# EAGLE design Adafruit Qualia Driver (EAGLE 6.5.0)
COMPANY: ADAFRUIT INDUSTRIES; DRAWN: K. TOWNSEND; REV: D
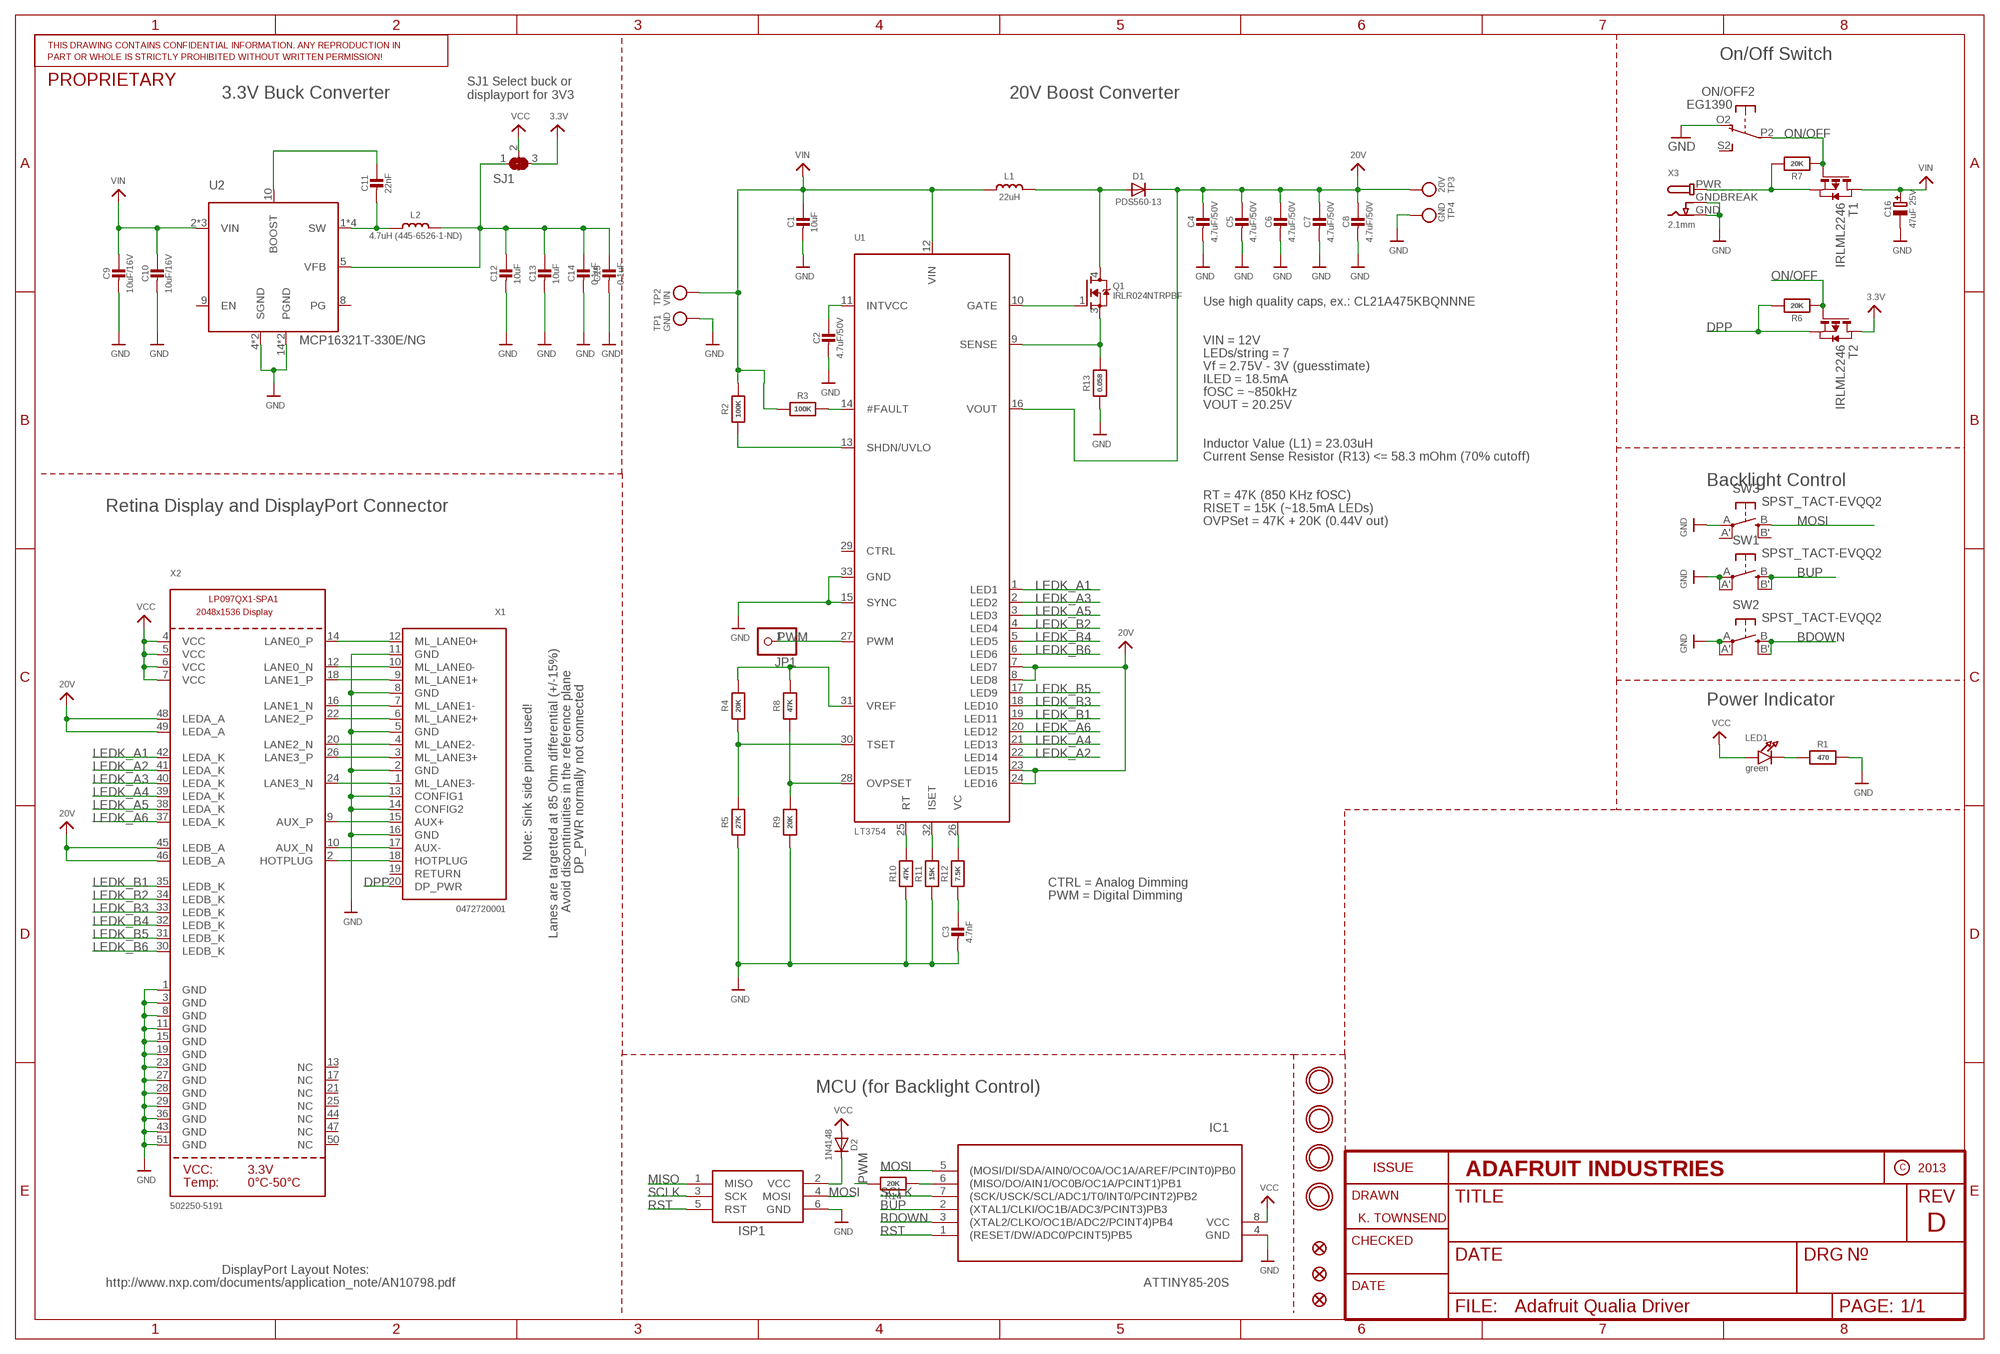
[diagram p0: schematic, sheet 1]

## Parts
C1  10uF  CAP_CERAMIC_0805  [_0805]
C2  4.7uF/50V  CAP_CERAMIC_0805  [_0805]
C3  4.7nF  CAP_CERAMIC_0805  [_0805]
C4  4.7uF/50V  CAP_CERAMIC_0805  [_0805]
C5  4.7uF/50V  CAP_CERAMIC_0805  [_0805]
C6  4.7uF/50V  CAP_CERAMIC_0805  [_0805]
C7  4.7uF/50V  CAP_CERAMIC_0805  [_0805]
C8  4.7uF/50V  CAP_CERAMIC_0805  [_0805]
C9  10uF/16V  CAP_CERAMIC_0805  [_0805]
C10  10uF/16V  CAP_CERAMIC_0805  [_0805]
C11  22nF  CAP_CERAMIC_0805  [_0805]
C12  10uF  CAP_CERAMIC_0805  [_0805]
C13  10uF  CAP_CERAMIC_0805  [_0805]
C14  0.1uF  CAP_CERAMIC_0805  [_0805]
C15  0.1uF  CAP_CERAMIC_0805  [_0805]
C16  47uF 25V  CAP_ELECTROLYTICPANASONIC_C  [PANASONIC_C]
D1  PDS560-13  DIODEPOWERDI  [POWERDI-5]
D2  1N4148  DIODESOD-323  [SOD-323]
FID1  FIDUCIAL""  [FIDUCIAL_1MM]
FID2  FIDUCIAL""  [FIDUCIAL_1MM]
FID3  FIDUCIAL""  [FIDUCIAL_1MM]
IC1  ATTINY85-20S  [SOIC8]
ISP1  AVRISP-6  [AVRISP]
JP1  PINHD-1X1CB  [1X01-CLEANBIG]
L1  22uH  INDUCTORCDRH5D28  [INDUCTOR_6X6MM_SUMIDA_CDRH5D28]
L2  4.7uH (445-6526-1-ND)  INDUCTORTDK_VLC5045  [INDUCTOR_5X5MM_TDK_VLC5045]
LED1  green  LED0805  [CHIPLED_0805]
ON/OFF  EG1390  DPDT-EG1390  [EG1390]
Q1  IRLR024NTRPBF  MOSFET-NDPAK  [DPAK]
R1  470  RESISTOR_0805  [_0805]
R2  100K  RESISTOR_0805  [_0805]
R3  100K  RESISTOR_0805  [_0805]
R4  20K  RESISTOR_0805  [_0805]
R5  27K  RESISTOR_0805  [_0805]
R6  20K  RESISTOR_0805MP  [_0805MP]
R7  20K  RESISTOR_0805MP  [_0805MP]
R8  47K  RESISTOR_0805  [_0805]
R9  20K  RESISTOR_0805  [_0805]
R10  47K  RESISTOR_0805  [_0805]
R11  15K  RESISTOR_0805  [_0805]
R12  7.5K  RESISTOR_0805  [_0805]
R13  0.058  RESISTOR2512  [2512]
R14  20K  RESISTOR_0805  [_0805]
SJ1  SOLDERJUMPER_2WAY  [SOLDERJUMPER_2WAY_OPEN_NOPASTE]
SW1  SPST_TACT-EVQQ2  [EVQ-Q2]
SW2  SPST_TACT-EVQQ2  [EVQ-Q2]
SW3  SPST_TACT-EVQQ2  [EVQ-Q2]
T1  IRLML2246  PMOSSOT23  [SOT-23]
T2  IRLML2246  PMOSSOT23  [SOT-23]
TP1  GND  TESTPOINTROUND1MM  [TESTPOINT_ROUND_1MM]
TP2  VIN  TESTPOINTROUND1MM  [TESTPOINT_ROUND_1MM]
TP3  20V  TESTPOINTROUND1MM  [TESTPOINT_ROUND_1MM]
TP4  GND  TESTPOINTROUND1MM  [TESTPOINT_ROUND_1MM]
U1  LT3754  VREG_LT3754  [QFN32_5MM]
U2  MCP16321T-330E/NG  VREG_MCP16321/2  [QFN16_3MM]
U$11  MOUNTINGHOLE3.0THIN  [MOUNTINGHOLE_3.0_PLATEDTHIN]
U$32  MOUNTINGHOLE3.0THIN  [MOUNTINGHOLE_3.0_PLATEDTHIN]
U$33  MOUNTINGHOLE3.0THIN  [MOUNTINGHOLE_3.0_PLATEDTHIN]
U$34  MOUNTINGHOLE3.0THIN  [MOUNTINGHOLE_3.0_PLATEDTHIN]
X1  0472720001  DISPLAYPORTSINKSIDE  [DISPLAYPORT_0472720001]
X2  502250-5191  DISP_DISPLAYPORT_LP097QX1-SPA1HANDSOLDERING  [FPC_51PIN_502250-5191_EXT]
X3  2.1mm  DCBARRELSMT_CORRECT  [DCJACK_2MM_SMT]

## Nets
3.3V: SJ1.3 T2.1(D)
20V: C4.1 C5.1 C6.1 C7.1 C8.1 D1.C TP3.P$1 U1.7(LED7) U1.8(LED8) U1.16(VOUT) U1.23(LED15) U1.24(LED16) X2.45(LEDB_A) X2.46(LEDB_A) X2.48(LEDA_A) X2.49(LEDA_A)
AUX+: X1.15(AUX+) X2.9(AUX_P)
AUX-: X1.17(AUX-) X2.10(AUX_N)
BDOWN: IC1.3((XTAL2/CLKO/OC1B/ADC2/PCINT4)PB4) SW2.B'(S1) SW2.B(S)
BUP: IC1.2((XTAL1/CLKI/OC1B/ADC3/PCINT3)PB3) SW1.B'(S1) SW1.B(S)
DPP: R6.2 T2.2(S) X1.20(DP_PWR)
GND: C1.2 C2.2 C3.2 C4.2 C5.2 C6.2 C7.2 C8.2 C9.2 C10.2 C12.2 C13.2 C14.2 C15.2 C16.- IC1.4(GND) ISP1.6(GND) ON/OFF.O2(2:O) R1.2 R5.1 R9.1 R10.1 R11.1 R13.1 SW1.A'(P1) SW1.A(P) SW2.A'(P1) SW2.A(P) SW3.A(P) TP1.P$1 TP4.P$1 U1.15(SYNC) U1.33(GND) U2.4(SGND) U2.14(PGND) U2.15(PGND) U2.THERMAL(SGND) X1.2(GND) X1.5(GND) X1.8(GND) X1.11(GND) X1.13(CONFIG1) X1.14(CONFIG2) X1.16(GND) X2.1(GND) X2.3(GND) X2.8(GND) X2.11(GND) X2.15(GND) X2.19(GND) X2.23(GND) X2.27(GND) X2.28(GND) X2.29(GND) X2.36(GND) X2.43(GND) X2.51(GND) X3.GND X3.GNDBREAK
HOTPLUG: X1.18(HOTPLUG) X2.2(HOTPLUG)
LEDK_A1: U1.1(LED1) X2.42(LEDA_K)
LEDK_A2: U1.22(LED14) X2.41(LEDA_K)
LEDK_A3: U1.2(LED2) X2.40(LEDA_K)
LEDK_A4: U1.21(LED13) X2.39(LEDA_K)
LEDK_A5: U1.3(LED3) X2.38(LEDA_K)
LEDK_A6: U1.20(LED12) X2.37(LEDA_K)
LEDK_B1: U1.19(LED11) X2.35(LEDB_K)
LEDK_B2: U1.4(LED4) X2.34(LEDB_K)
LEDK_B3: U1.18(LED10) X2.33(LEDB_K)
LEDK_B4: U1.5(LED5) X2.32(LEDB_K)
LEDK_B5: U1.17(LED9) X2.31(LEDB_K)
LEDK_B6: U1.6(LED6) X2.30(LEDB_K)
MISO: IC1.6((MISO/DO/AIN1/OC0B/OC1A/PCINT1)PB1) ISP1.1(MISO) R14.1
MOSI: IC1.5((MOSI/DI/SDA/AIN0/OC0A/OC1A/AREF/PCINT0)PB0) ISP1.4(MOSI) SW3.B(S)
N$1: X1.12(ML_LANE0+) X2.14(LANE0_P)
N$2: X1.10(ML_LANE0-) X2.12(LANE0_N)
N$3: X1.9(ML_LANE1+) X2.18(LANE1_P)
N$4: X1.7(ML_LANE1-) X2.16(LANE1_N)
N$5: X1.6(ML_LANE2+) X2.22(LANE2_P)
N$6: X1.4(ML_LANE2-) X2.20(LANE2_N)
N$7: X1.3(ML_LANE3+) X2.26(LANE3_P)
N$8: X1.1(ML_LANE3-) X2.24(LANE3_N)
N$9: C2.1 U1.11(INTVCC)
N$10: R2.1 U1.13(SHDN/UVLO)
N$11: R3.2 U1.14(#FAULT)
N$12: R12.2 U1.26(VC)
N$13: C3.1 R12.1
N$14: LED1.C R1.1
N$15: R4.1 R5.2 U1.30(TSET)
N$16: R4.2 R8.2 U1.31(VREF)
N$17: R7.2 T1.2(S) X3.PWR
N$19: R8.1 R9.2 U1.28(OVPSET)
N$20: R10.2 U1.25(RT)
N$21: D2.C ISP1.2(VCC)
N$22: R11.2 U1.32(ISET)
N$23: Q1.3(S) R13.2 U1.9(SENSE)
N$24: Q1.1(G) U1.10(GATE)
N$25: D1.A1(A) D1.A2(A) L1.P$2 Q1.4(D)
N$27: C12.1 C13.1 C14.1 C15.1 L2.P$2 SJ1.1 U2.5(VFB)
N$28: C11.1 U2.10(BOOST)
N$29: C11.2 L2.P$1 U2.1(SW) U2.12(SW) U2.13(SW) U2.16(SW)
ON/OFF: ON/OFF.P2(2:P) R6.1 R7.1 T1.3(G) T2.3(G)
PWM: JP1.1 R14.2 U1.27(PWM)
RST: IC1.1((RESET/DW/ADC0/PCINT5)PB5) ISP1.5(RST)
SCLK: IC1.7((SCK/USCK/SCL/ADC1/T0/INT0/PCINT2)PB2) ISP1.3(SCK)
VCC: D2.A IC1.8(VCC) LED1.A SJ1.2 X2.4(VCC) X2.5(VCC) X2.6(VCC) X2.7(VCC)
VIN: C1.1 C9.1 C10.1 C16.+ L1.P$1 R2.2 R3.1 T1.1(D) TP2.P$1 U1.12(VIN) U2.2(VIN) U2.3(VIN) U2.11(VIN)
Unconnected: ON/OFF.O1(1:O) ON/OFF.P1(1:P) ON/OFF.S1(1:S) ON/OFF.S2(2:S) SW3.A'(P1) SW3.B'(S1) U1.29(CTRL) U2.8(PG) U2.9(EN) X1.19(RETURN) X2.13(NC) X2.17(NC) X2.21(NC) X2.25(NC) X2.44(NC) X2.47(NC) X2.50(NC)

## Notes on the sheet
- On/Off Switch
- 3.3V Buck Converter
- SJ1 Select buck or
  displayport for 3V3
- 20V Boost Converter
- Use high quality caps, ex.: CL21A475KBQNNNE
- VIN = 12V
- LEDs/string = 7
- Vf = 2.75V - 3V (guesstimate)
- ILED = 18.5mA
- fOSC = ~850kHz
- VOUT = 20.25V
- Inductor Value (L1) = 23.03uH
- Current Sense Resistor (R13) <= 58.3 mOhm (70% cutoff)
- Backlight Control
- RT = 47K (850 KHz fOSC)
- Retina Display and DisplayPort Connector | RISET = 15K (~18.5mA LEDs)
- OVPSet = 47K + 20K (0.44V out)
- Power Indicator
- Note: Sink side pinout used!
- DP_PWR normally not connected
- CTRL = Analog Dimming
- PWM = Digital Dimming
- Avoid discontinuities in the reference plane
- Lanes are targetted at 85 Ohm differential (+/-15%)
- MCU (for Backlight Control)
- DisplayPort Layout Notes:
- http://www.nxp.com/documents/application_note/AN10798.pdf

## Library data of the parts
C1-C15 = microbuilder:CAP_CERAMIC: Ceramic Capacitors For new designs, use the packages preceded by an '_' character since they are more reliable: The following footprints should be used on most boards: _0402 - Standard footprint for regular board layouts _0603 - Standard footprint for regular board layouts _0805 - Standard footprint for regular board layouts _1206 - Standard footprint for regular board layouts For extremely tight-pitch boards where space is at a premium, the following 'micro-pitch' footprints can be used (smaller pads, no silkscreen outline, etc.): _0402MP - Micro-pitch footprint for very dense/compact boards _0603MP - Micro-pitch footprint for very dense/compact boards _0805MP - Micro-pitch footprint for very dense/compact boards _1206MP - Micro-pitch footprint for very dense/compact boards
C16 = microbuilder:CAP_ELECTROLYTIC: Electrolytic Capacitors SMT PANASONIC_C - Size C Panasonic Electrolytic Aluminum Capacitor 47µF 16V 20% Electrolytic Capacitor [Digikey: PCE3890TR-ND] PANASONIC_D - Size D Panasonic Electrolytic Aluminum Capacitor 100µF 25V 20% Electrolytic Capacitor [Digikey: PCE3898TR-ND] PTH 3.5 mm grid, 8 mm diameter ... 3.5 mm grid, 10 mm diameter ...
D1 D2 = microbuilder:DIODE: Diode SMA Model Volts Amps Type Vf Ir Digikey # Notes SSA34-E3 40V 3A Schottky 480mV @ 3A 200uA @ 40V SSA34-E3/61TGITR-ND CDBA120-G 20V 1A Schottky 500mV @ 1A 500uA @ 20V 641-1014-6-ND REEL MBRA210 10V 2A Schottky 350mV @ 2A 700uA @ 10V MBRA210LT3 SOD-123 Model Volts Amps Type Vf Ir Order # Notes BAT54T1G 30V 200mA Schottky 800mV @ 200mA 2uA @ 25V BAT54T1GOSTR-ND B0530W 30V 500mA Schottky 430mV @ 500mA 130uA @ 30V B0530W-FDICT-ND REEL MBR120 20V 1A Schottky 340mV @ 1A MBR120VLSFT1GOSCT-ND SOD-323 Model Volts Amps Type Vf Ir Order # Notes PMEG2005EJ 20V 500mA Schottky 355mV @ 500mA 568-4110-1-ND ZLLS410 10V 570mA Schottky 380mV @ 570mA ZLLS410CT-ND 1N4148WS 75V 150mA Silicon/Simple 1V 1N4148WSFSCT-ND REEL SOD-523 Model Volts Amps Type Vf Ir Order # Notes BAT54XV2 30V 200mA Schottky 0.8V @ 100mA BAT54XV2CT-ND TB751S 30V 30mA Schottky RB751S-40TE61CT-ND SOT23-R/W (R = Solder Paste/Reflow Ovens, W = Hand-Soldering) Model Volts Amps Type Vf Ir Order # Notes BAT54FILM 40V 300mA Schottky 497-7162-1-ND POWERDI-5 Model Volts Amps Type Vf Ir Order # Notes PDS560 60V 5A Schottky 670mV @ 5A 150uA @ 60V PDS560DICT-ND
FID1-FID3 = microbuilder:FIDUCIAL: Fiducial Alignment Points Various fiducial points for machine vision alignment.; BOM: EXCLUDE
IC1 = avr:ATTINY85: MICROCONTROLLER 8 Kbytes FLASH 512 bytes EEPROM 512 bytes RAM 4-channel 10 bit ADC USI
ISP1 = adafruit:AVRISP: AVR ISP HEADER Standard 6 pin header for AVR programming
JP1 = adafruit:PINHD-1X1: Pin header 1x1 for 0.1" spacing With round pins
L1 L2 = microbuilder:INDUCTOR: Inductors 0603: 10nH Ceramic Inductor - microwire antenna/RF (Digikey: 712-1434-2-ND) 0805: 560nH Ceramic Inductor - RF (Digikey: 553-1047-1-ND) 270nH Ceramic Inductor - Q = 40@250MHz, +-5%, 1 Ohm DC Resistance (Digikey: 535-10506-2-ND) 1007 (2518 Metric) SMT: 10µH 10% 250mOhm 820mA 1007 Inductor (Digikey: 587-2189-1-ND) 22µH 10% 500mOhm 580mA 1007 Inductor (Digikey: 587-2190-1-ND) 47µH 10% 950mOhm 420mA 1007 Inductor (Digikey: 587-2191-1-ND) 47µH 5% 100mOhm 1A 1008 Inductor (Digikey: 732-1816-1-ND) 5.0x5.0mm (Taiyo Yuden NR5040 Series) 6.8µH 20% 2.3A 64mOhm Inductor (Digikey: 587-2374-2-ND) 5.0x5.0mm (TDK VLC5045 Series) 4.7µH 20% 3.3A 34mOhm Inductor (Digikey: 445-6526-1-ND) 6.8µH 20% 2.7A 46mOhm Inductor (Digikey: 445-6527-1-ND) 6.0x6.0mm (TDK VLC6045 Series) 4.7µH 20% 3.8A 27mOhm Inductor (Digikey: 445-6538-2-ND) 6.8µH 20% 3A 41mOhm Inductor (Digikey: 445-6540-1-ND) 6.2µH 30% 2.2A 45mOhm Inductor (Digikey: SRR5028-6R2YCT-ND) - Not TDK VLC6045 but footprint should match 6.0x6.0mm (TDK SLF6045 Series) 6.8uH 30% 2A 33mOhm Inductor (Digikey: 445-4572-1-ND, Mouser: 810-SLF645T6R8N2R0PF) 6.0x6.0mm (Sumida CDRH5D28 Series) 6.2uH 30% 1.8A 45mOhm Inductor (Digikey: 308-1542-1-ND) Taiyo Yuden NR3015T2R2M - 2.2uH 20% 1.5A (Digikey: 587-1648-2-ND, Mouser: 963-NR3015T2R2M) - Used with TI TPS62172 CoilCraft RFID Transponder Coil - MA5532-AE (For use with AS3935 Lightning Sensor)
LED1 = microbuilder:LED: LED 0603 - 0603 Surface Mount Package 2mA: Green LED - Low Power (3.9mcd, 2ma, 1.7Vf) - Digikey: 475-2709-2-ND Orange LED - Low Power (9.8mcd, 2ma, 1.8Vf) - Digikey: 475-1194-2-ND Red LED - Low Power (5mcd, 2ma, 1.8Vf) - Digikey: 475-1195-2-ND Yellow LED - Low Power (7mcd, 2ma, 1.8Vf) - Digikey: 475-1196-2-ND 5mA: Blue LED - Low Power (17mcd, 5ma, 2.9Vf) - Digikey: LNJ937W8CRACT-ND 0805 - 0805 Surface Mount Package 2mA: Red LED (8.8mcd, 2mA, 1.8Vf, Clear) - Low Power [Digikey: 475-2510-1-ND] Green LED (5mcd, 2mA, 1.8Vf, Clear) - Low Power [Digikey: 475-2730-1-ND] Yellow LED (11.3mcd, 2mA, 1.8Vf, Clear) - Low Power [Digikey: 475-2555-1-ND] 20mA: Red LED (104mcd, 20mA, Diffused) - LS R976 [Digikey: 475-1278-6-ND] Red LED (12mcd, 20mA, 2.0Vf, Clear) - APT2012EC [Digikey: 754-1128-1-ND] Green LED (15mcd, 20mA, 2.2Vf, Clear) - APT2012GC [Digikey: 754-1131-1-ND] Orange LED (160mcd, 20mA, 2.1Vf, Clear) - APT2012SECK [Digikey: 754-1130-1-ND] 1206 - 1206 Surface Mount Package Green LED (26mcd, 20mA, Diffused) - LG N971 [Digikey: 475-1407-6-ND] Red LED (15mcd, 20mA, Diffused) - LH N974 [Digikey: 475-1416-6-ND] Cree - Cree High-Power Surface Mount LEDs XPEBWT-L1-0000-00D50 - White 111lm 350mA 2.9Vf 6200K 110° XTEAWT-00-0000-00000LEE3 - White 114lm 350mA 2.85Vf 5000K 115° Everlight - Everlight 45-21 Series Surface Mount LEDs 45-21/QK2C-B2832AC2CB2/2T - Warm White 2000mcd 20mA 3.25Vf 3050K 120° 45-21/LK2C-B38452C4CB2/2T - Nuetral White 2000mcd 20mA 3.25Vf 4150K 120° 45-21/LK2C-B50634C6CB2/2T - Cold White 2200mcd 20mA 3.25Vf 5650K 120° PLCC2 Reverse Mount LS T77K-J1L2-1-0-2-R18-Z - Red 11.25mcd 2mA 1.8Vf 630nm 120° LO T77K-L1M2-24-Z - Orange 19.6mcd 2mA 1.8Vf 606nm 120° LY T77K-K2M1-26-Z - Yellow 15.7mcd 2mA 1.8Vf 587nm 120°
ON/OFF = adafruit:DPDT
Q1 = microbuilder:MOSFET-N: N-Channel Mosfet LEGEND VDS: Voltage Drain-Source ID: Drain Current RDS(ON): Drain-Source On-State Resistance VGS(TH): Gate-Source Threshold Voltage CISS: Drain-Source Input Capacitance SOT-23 Name VDS ID RDS(ON) VGS(TH) CISS Order Number 2N7002E 60V 260mA 2.5 Ohm 2.5V @ 250uA 26.7pF @ 25V 2N7002ET1GOSTR-ND BSH103 30V 850mA 400 mOhm 400mV @ 1mA 83pF @ 24V BSH103,235-ND BSS138 60V 320mA 1.6 Ohm 1.5V @ 250uA 50pF @ 10V Mouser: 771-BSS138PW115 DMN2075U-7 20V 4.2A 38 mOhm 1V @ 250 uA 594.3pF @ 10V DMN2075U-7DICT-ND * BSS138 good choice for I2C level-shifting POWERPAK 1212-8 Name VDS ID RDS(ON) VGS(TH) CISS Order Number Si7308DN 60V 6A 58 mOhm 3V @ 250uA 665pF @ 15V SI7308DN-T1-E3CT-ND
R1-R14 = microbuilder:RESISTOR: Resistors For new designs, use the packages preceded by an '_' character since they are more reliable: The following footprints should be used on most boards: _0402 - Standard footprint for regular board layouts _0603 - Standard footprint for regular board layouts _0805 - Standard footprint for regular board layouts _1206 - Standard footprint for regular board layouts For extremely tight-pitch boards where space is at a premium, the following 'micro-pitch' footprints can be used (smaller pads, no silkscreen outline, etc.): _0402MP - Micro-pitch footprint for very dense/compact boards _0603MP - Micro-pitch footprint for very dense/compact boards _0805MP - Micro-pitch footprint for very dense/compact boards _1206MP - Micro-pitch footprint for very dense/compact boards
SJ1 = microbuilder:SOLDERJUMPER_2WAY: 2-Way Solder Jumper
SW1-SW3 = adafruit:SPST_TACT: SMT 6mm switch, EVQQ2 series http://www.ladyada.net/library/eagle
T1 T2 = zetex:PMOSSOT23: MOS FET
TP1-TP4 = microbuilder:TESTPOINT: Test Point Various test points for characterisation and PCB testing TESTPOINT_SMT - Compact Surface Mount Test Point [Digikey: 5016KTR-ND]
U1 = microbuilder:VREG_LT3754: LT3754 - 16-Channel x 50mA per LED Boost 6V to 40V Input Up to 45V Output (per channel) Single resistor sets current (10-50mA)
U2 = microbuilder:VREG_MCP16321/2: MCP16321/2 - 24V, 1A/2A Buck Regulator Input Voltage: 6-24V Output Current: 1A (MCP16321), 2A (MCP16322) Output Frequency: 1MHz Operating Temperature: -40 - 125°C
U$11 U$32-U$34 = microbuilder:MOUNTINGHOLE: Mounting Hole For #2 screws (0.086"/2.18mm width, 0.094"/2.4mm hole) use 2.5mm; BOM: EXCLUDE
X1 = microbuilder:DISPLAYPORT: 20-Pin DisplayPort Connector Connector: Molex 0472720001 Warning: Note the difference between source and sink side pinouts! For pinout information see: http://www.displayport.net/wp-content/uploads/2012/10/displayport_pinout11a.gif
X2 = microbuilder:DISP_DISPLAYPORT_LP097QX1-SPA1: Connector: Molex 502250-5191
X3 = microbuilder:DCBARREL: DC Barrel Jack DCJACK_1.3MM_PTH - Through Hole 1.3mm Jack (4UConnector: 05536) DCJACK_2MM_PTH - Through Hole 2.0/2.1 Jack (4UConnector: 05537) DCJACK_2MM_SMT - SMT 2.0/2.1mm Jack(4UConnector: 03267)

## Board
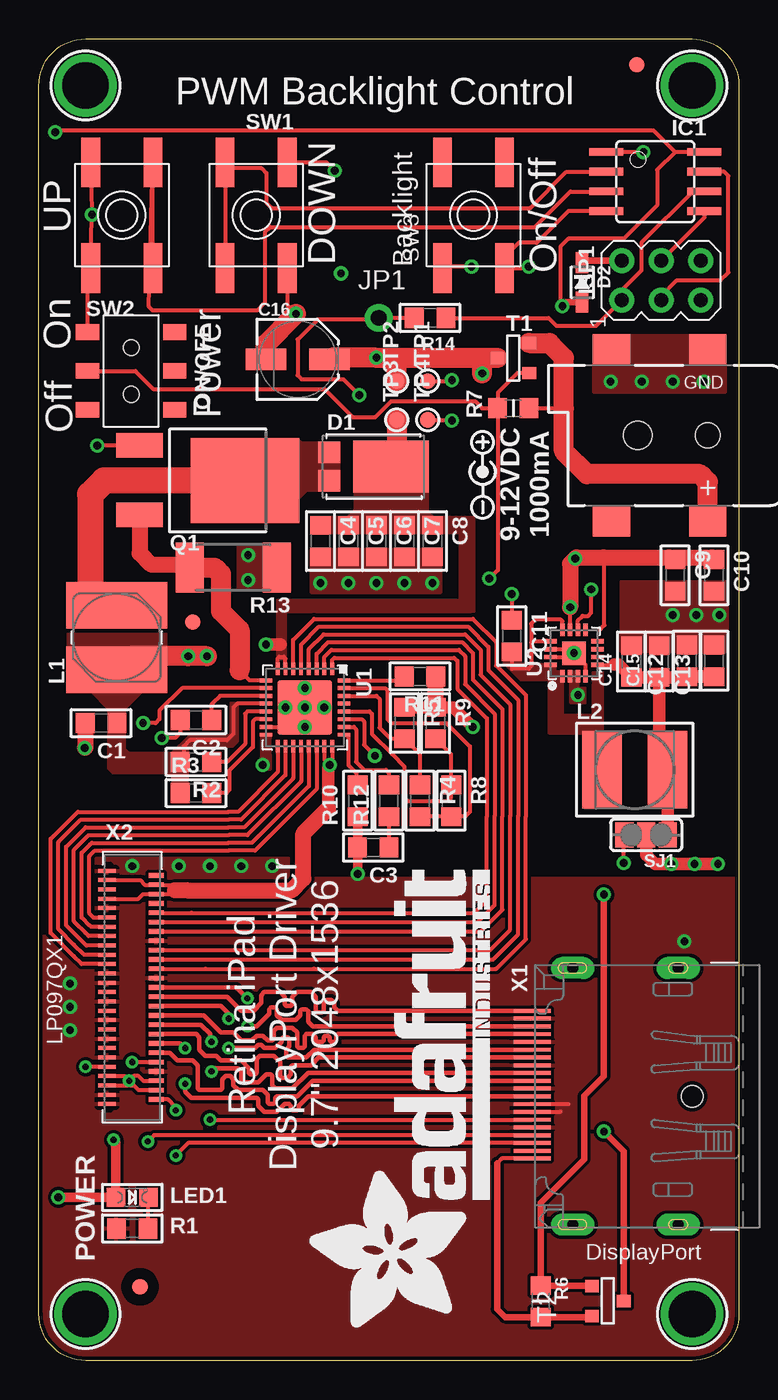
[diagram p1: board, top side]
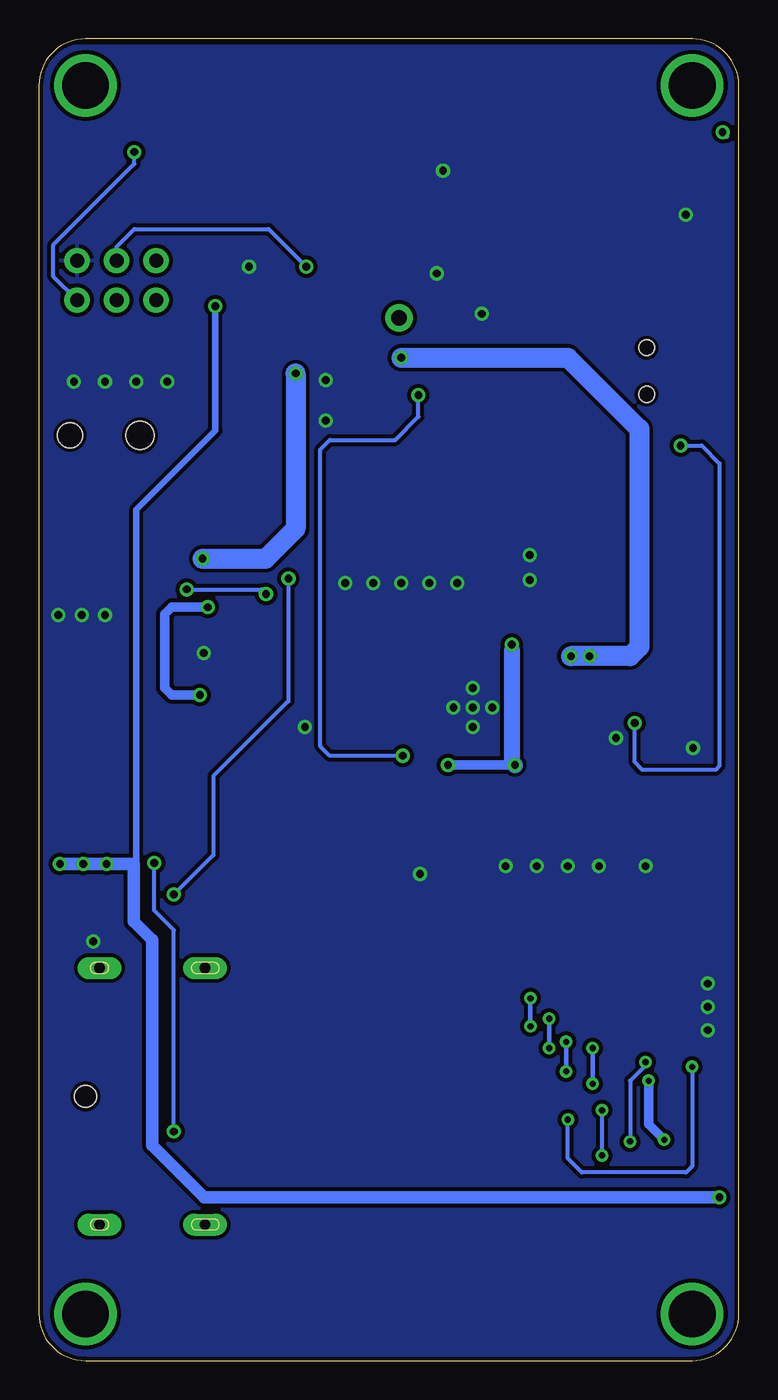
[diagram p2: board, bottom side, seen from below]

Size 45 x 85 mm. Coordinates in mm from the lower left corner, seen from the top.
Outline: 0,3 0,82 arc-90 3,85 42,85 arc-90 45,82 45,3 arc-90 42,0 3,0 arc-90 0,3
Copper layers (1*16): Top 0.035mm / dielectric 1.5mm / Bottom 0.035mm
Design rules "adafruit": minimum track width 8mil, minimum drill 15.5mil, track to track 8mil, track to pad 8mil, pad to pad 8mil, via to via 8mil, smd to smd 8mil, copper to edge 10mil, drill to drill 8mil, minimum pad ring 10mil, minimum via ring 8mil, stop-mask expansion 4mil, vias tented up to drill 20mil, thermal gap 10mil
tRestrict: area 31.5,16.2 to 31.9,16.3; area 4.2,24.6 to 4.5,24.6; area 4.2,31.8 to 4.6,31.9; area 4.2,16.8 to 4.6,16.9; area 4.2,16.2 to 4.6,16.2

### Footprints (pad centres in the part's own frame; a part is rotated, then mirrored left to right if it is on the bottom)
_0805 = smd 1.2 x 1.3: 1 -1.016,0; 2 1.016,0
PANASONIC_C = smd 2.6 x 1.4: + 2.05,0; - -2.05,0
POWERDI-5 = smd 1.39 x 1.4: A1 -0.92,-2.84; A2 0.92,-2.84 | smd 3.36 x 4.86: C 0,1.142
SOD-323 = smd 1.35 x 0.8: A 1.27,0; C -1.27,0
FIDUCIAL_1MM = smd 1 x 1: 1 0,0
SOIC8 = smd 0.5 x 2.2: 1 -1.905,-3.154; 2 -0.645,-3.154; 3 0.625,-3.154; 4 1.895,-3.154; 5 1.905,3.154; 6 0.635,3.154; 7 -0.635,3.154; 8 -1.905,3.154
AVRISP = drill 0.9 pad 1.626: 1 -1.27,2.54; 2 1.27,2.54; 3 -1.27,0; 4 1.27,0; 5 -1.27,-2.54; 6 1.27,-2.54
1X01-CLEANBIG = drill 1.016 pad 1.778: 1 0,0
INDUCTOR_6X6MM_SUMIDA_CDRH5D28 = smd 3 x 6.5: P$1 -2.075,0; P$2 2.075,0
INDUCTOR_5X5MM_TDK_VLC5045 = smd 2.54 x 5: P$1 -2.096,0; P$2 2.096,0
CHIPLED_0805 = smd 1.2 x 1.2: A 0,-1.05; C 0,1.05
EG1390 = smd 1 x 1.5: O1 -2.5,2.8; O2 -2.5,-2.8; P1 0,2.8; P2 0,-2.8; S1 2.5,2.8; S2 2.5,-2.8 | hole 1: 1.5,0; -1.5,0
DPAK = smd 1.6 x 2.997: 1 -2.261,-4.928; 3 2.21,-4.928 | smd 5.452 x 7: 4 0,1.853
_0805MP = smd 1.2 x 1.3: 1 -1.016,0; 2 1.016,0
2512 = smd 1.8 x 3.2: 1 -2.8,0; 2 2.8,0
SOLDERJUMPER_2WAY_OPEN_NOPASTE = smd 1.168 x 1.6: 1 -1.397,0; 2 0,0; 3 1.397,0
EVQ-Q2 = smd 3.2 x 1.2: A -3.4,-2; A' 3.4,-2; B -3.4,2; B' 3.4,2
SOT-23 = smd 0.787 x 0.889: 1 0.025,-1.016; 2 -0.94,1.016; 3 0.991,1.016
TESTPOINT_ROUND_1MM = smd 1 x 1: P$1 0,0
QFN32_5MM = smd 0.8 x 0.25: 1 -2.5,1.75; 2 -2.5,1.25; 3 -2.5,0.75; 4 -2.5,0.25; 5 -2.5,-0.25; 6 -2.5,-0.75; 7 -2.5,-1.25; 8 -2.5,-1.75; 17 2.5,-1.75; 18 2.5,-1.25; 19 2.5,-0.75; 20 2.5,-0.25; 21 2.5,0.25; 22 2.5,0.75; 23 2.5,1.25; 24 2.5,1.75 | smd 0.25 x 0.8: 9 -1.75,-2.5; 10 -1.25,-2.5; 11 -0.75,-2.5; 12 -0.25,-2.5; 13 0.25,-2.5; 14 0.75,-2.5; 15 1.25,-2.5; 16 1.75,-2.5; 25 1.75,2.5; 26 1.25,2.5; 27 0.75,2.5; 28 0.25,2.5; 29 -0.25,2.5; 30 -0.75,2.5; 31 -1.25,2.5; 32 -1.75,2.5 | smd 3.5 x 3.5: 33 0,0
QFN16_3MM = smd 0.8 x 0.28: 1 -1.5,0.75; 2 -1.5,0.25; 3 -1.5,-0.25; 4 -1.5,-0.75; 9 1.5,-0.75; 10 1.5,-0.25; 11 1.5,0.25; 12 1.5,0.75 | smd 0.28 x 0.8: 5 -0.75,-1.5; 6 -0.25,-1.5; 7 0.25,-1.5; 8 0.75,-1.5; 13 0.75,1.5; 14 0.25,1.5; 15 -0.25,1.5; 16 -0.75,1.5 | smd 1.5 x 1.5: THERMAL 0,0
MOUNTINGHOLE_3.0_PLATEDTHIN = drill 3 pad 3.6: P$1 0,0
DISPLAYPORT_0472720001 = smd 0.25 x 2.4: 1 5.5,10.28; 2 5,10.28; 3 4.5,10.28; 4 4,10.28; 5 3.5,10.28; 6 3,10.28; 7 2.5,10.28; 8 2,10.28; 9 1.5,10.28; 10 1,10.28; 11 0.5,10.28; 12 0,10.28; 13 -0.5,10.28; 14 -1,10.28; 15 -1.5,10.28; 16 -2,10.28; 17 -2.5,10.28; 18 -3,10.28; 19 -3.5,10.28; 20 -4,10.28 | drill 0.7 pad 1.4 long: P$2 8.25,0.9; P$3 -8.25,0.9; P$4 8.25,7.68; P$5 -8.25,7.68 | hole 1.4: 0,0
FPC_51PIN_502250-5191_EXT = smd 0.26 x 1.1: 1 7.5,-1.625; 3 6.9,-1.625; 5 6.3,-1.625; 7 5.7,-1.625; 9 5.1,-1.625; 11 4.5,-1.625; 13 3.9,-1.625; 15 3.3,-1.625; 17 2.7,-1.625; 19 2.1,-1.625; 21 1.5,-1.625; 23 0.9,-1.625; 25 0.3,-1.625; 27 -0.3,-1.625; 29 -0.9,-1.625; 31 -1.5,-1.625; 33 -2.1,-1.625; 35 -2.7,-1.625; 37 -3.3,-1.625; 39 -3.9,-1.625; 41 -4.5,-1.625; 43 -5.1,-1.625; 45 -5.7,-1.625; 47 -6.3,-1.625; 49 -6.9,-1.625; 51 -7.5,-1.625 | smd 0.3 x 0.95: 2 7.2,1.55; 4 6.6,1.55; 6 6,1.55; 8 5.4,1.55; 10 4.8,1.55; 12 4.2,1.55; 14 3.6,1.55; 16 3,1.55; 18 2.4,1.55; 20 1.8,1.55; 22 1.2,1.55; 24 0.6,1.55; 26 0,1.55; 28 -0.6,1.55; 30 -1.2,1.55; 32 -1.8,1.55; 34 -2.4,1.55; 36 -3,1.55; 38 -3.6,1.55; 40 -4.2,1.55; 42 -4.8,1.55; 44 -5.4,1.55; 46 -6,1.55; 48 -6.6,1.55; 50 -7.2,1.55
DCJACK_2MM_SMT = smd 2.4 x 2: GND 0,-5.5; GNDBREAK 6.2,-5.5; PWR 0,5.5; PWR2 6.2,5.5 | hole 1.6: 0,0 | hole 1.8: 4.5,0

### Placement (x,y rotation side)
C1  4,41 180 top
C2  10.1,41.2 180 top
C3  21.5,33 180 top
C4  18.1,52.7 270 top
C5  19.9,52.7 270 top
C6  21.7,52.7 270 top
C7  23.5,52.7 270 top
C8  25.3,52.7 270 top
C9  40.9,50.5 270 top
C10  43.4,50.5 270 top
C11  30.4,46.6 270 top
C12  41.66,45 90 top
C13  43.4,45 90 top
C14  38.1,44.96 90 top
C15  39.88,44.96 90 top
C16  16.64,64.39 0 top
D1  21.5,57.5 270 top
D2  34.92,69.34 270 top
FID1  6.5,4.75 0 top
FID2  38.43,83.34 0 top
FID3  9.9,47.5 0 top
IC1  39.62,75.82 270 top
ISP1  40.01,69.47 90 top
JP1  21.84,67.06 0 top
L1  5,46.5 90 top
L2  38.3,38 0 top
LED1  6,10.5 270 top
ON/OFF  5.93,63.64 270 top
Q1  11.4,56.6 270 top
R1  6,8.5 180 top
R2  10.1,38.5 180 top
R3  10.1,36.5 0 top
R4  24.5,36 270 top
R5  23.5,41 270 top
R6  32.26,3.81 270 top
R7  30.5,61.25 0 top
R8  26.5,36 270 top
R9  25.5,41 270 top
R10  20.5,36 90 top
R11  24.5,44 180 top
R12  22.5,36 90 top
R13  12.5,51 180 top
R14  25.15,67.06 180 top
SJ1  39.04,33.81 180 top
SW1  13.97,73.66 90 top
SW2  5.33,73.66 270 top
SW3  27.94,73.66 90 top
T1  30.5,64.5 270 top
T2  36.58,3.81 90 top
TP1  25,63 90 top
TP2  23,63 90 top
TP3  23,60.5 90 top
TP4  25,60.5 90 top
U1  17.1,42 270 top
U2  34.4,45.5 90 top
U$10  [SYMBOL_POSITIVE_CENTER-M]  28.53,57.15 270 top
U$11  42,3 0 top
U$32  42,82 0 top
U$33  3,82 0 top
U$34  3,3 0 top
U$39  [ADAFRUIT_TEXT_30MM]  28.96,1.91 90 top
X1  42,17 90 top
X2  6,24 270 top
X3  43,59.5 180 top

### Tracks (layer width: path | path; a pad name or v marks a point on that pad's centre or on a via)
3.3V  (via drill 0.5)
  Top 0.254: v37.59,32 37.59,33.76 SJ1.3
  Top 0.406: T2.1 37.59,13.46 v36.32,14.73
  Bottom 0.254: v36.32,14.73 36.32,27.69 37.59,28.96 v37.59,32
20V  (via drill 0.5)
  Top 0.25: X2.49 6.5,30.9 6.8,30.6 X2.48 | X2.45 6.4,29.7 6.7,30 X2.46
  Top 0.254: X2.46 8.75,30 8.75,30.25 8.65,30.6 | X2.48 9.15,30.6 9.5,30.25 | 18.35,38.15 18.6,38.1 | U1.8 15.35,45.15 15.45,45.25 15.75,45.25 15.85,45.15 U1.7 | U1.24 18.85,38.45 v18.7,38.3 18.35,38.65 U1.23
  Top 0.61: v18.7,38.3 18.7,38.2 18.6,38.1
  Top 0.813: 18.6,35.5 18.6,38.1 | v14.6,46.05 15.55,46.05
  Top 1.016: 8.75,30.25 9.5,30.25 16.25,30.25 17,31 17,33.9 18.6,35.5
  Top 1.27: TP3.P$1 23,57.86 D1.C
  Bottom 0.61: v18.7,38.3 v14.4,38.3
  Bottom 0.813: 14.6,45.65 v14.6,46.05
  Bottom 1.016: 14.6,45.65 14.6,38.5 v14.4,38.3
  pour Top (isolate 0.254, no thermals): 17.55,53.25 27.1,53.3 27.1,48.85 15.35,48.85 15.35,45.2 15.85,45.2 15.85,48.2 27.95,48.2 27.95,54.2 25.35,54.2 24.95,54.6 24.95,59.05 20.35,59.05 20.35,54.7 19.85,54.2 17.55,54.2
  pour Top (isolate 0.254, no thermals): 14.35,40.25 14.85,40.25 14.85,38.05 14.35,38.05
AUX+  (via drill 0.4)
  Top 0.25: X2.9 v3,18.9 | v11,15.5 X1.15
  Bottom 0.25: v3,18.9 3,12.5 3.4,12.1 10.1,12.1 11,13 v11,15.5
AUX-  (via drill 0.4)
  Top 0.25: v6,19.2 X2.10 | X1.17 7.4,14.5 v7,14.1
  Bottom 0.25: v6,19.2 6,19 7,18 v7,14.1
BDOWN
  Top 0.254: SW2.B' SW2.B 7.06,67.77 7.31,67.53 14.02,67.53 14.52,68.03 14.52,72.56 14.86,72.9 31.88,72.9 34.16,75.18 IC1.3
BUP
  Top 0.254: SW1.B SW1.B' 12.36,76.67 14.32,76.67 14.62,76.37 14.62,74.47 14.97,74.12 31.57,74.12 33.91,76.45 IC1.2
DPP
  Top 0.254: X1.20 29.76,13 29.46,12.7
  Top 0.406: 29.46,12.7 29.46,3.3 29.97,2.79 R6.2 35.48,2.79 T2.2
GND  (via drill 0.5)
  Top 0.254: SW2.A v3.41,73.7 SW2.A' 3.13,69.66 ON/OFF.O2 | U2.4 35.15,44.75 U2.THERMAL | U2.14 34.15,45.75 U2.THERMAL | U2.15 34.15,45.25 U2.THERMAL | C2.2 9.08,40.38 8.75,40.05 v7.9,40.05 | 18.87,76.67 v19.02,76.52 18.48,77.06 SW1.A' | 19.47,69.97 v19.42,69.92 | TP4.P$1 26.5,60.5 v26.55,60.45 | TP1.P$1 26.5,63 v26.55,63.05 | U1.15 v17.1,40.75 | X1.13 34.03,16.5 34.04,16.51 | X1.14 33.53,16 | SW1.A 15.97,67.87 v16.52,67.32 | IC1.4 34.05,73.92 32,71.88 30.86,71.88 29.97,70.99 29.97,70.29 SW3.A 31.4,70.26 v31.5,70.36
  Top 0.61: R10.1 20.5,33.02 C3.2 20.48,31.32 v20.5,31.3
  Top 0.813: v27.9,40.75 26.63,42.02 R9.1 R5.1
  Top 1.016: C1.2 2.98,39.43 v2.95,39.4 | R9.1 25.5,43.98 R11.1
  Top 1.27: C16.- 14.59,65.38 v16.52,67.32
  Bottom 0.254: v31.5,70.36 31.5,70.61
  other vias: 41.5,26.95 2,24.25 2,22.75 2,21.25 6,31.8 40.75,47.95 42.25,47.95 43.75,47.95 34.4,45.5 18.1,50 19.9,50 21.7,50 23.5,50 13.45,51.8 13.45,50.2 36.75,62.95 38.75,62.95 40.75,62.95 42.75,62.95 9,31.8 11,31.8 13,31.8 15,31.8 25.3,50 17.1,42 17.1,43.25 15.85,42 18.35,42
  pour Bottom (isolate 0.254): 0,84.5 45,84.5 45,0 0,0
  pour Top (no thermals): 37.43,45.65 44.25,45.65 44.25,50.05 37.43,50.05
  pour Top (isolate 0.254, no thermals): 17.55,52.15 25.8,52.15 25.8,49.4 17.55,49.4
  pour Top (isolate 0.254, no thermals): 12.85,52.45 16.1,52.45 16.1,49.55 12.85,49.55
  pour Top (isolate 0.254, no thermals): 35.7,65.9 44.1,65.9 44.1,62.3 35.7,62.3
  pour Top (isolate 0.21): 0,3 0,32.3 16,32.3 16,31 45,31 45,3 arc-90 42,0 3,0 arc-90
HOTPLUG  (via drill 0.4)
  Top 0.25: X1.18 9.6,14 v8.8,13.2 | v8.8,16.1 8.8,16.3 8.3,16.8 X2.2
  Bottom 0.25: v8.8,13.2 v8.8,16.1
LEDK_A1
  Top 0.254: X2.42 9.8,28.8 17.75,28.8 28,28.8 28.8,29.6 28.8,35 28.8,41.3 26.9,43.2 26.9,45 26.7,45.2 19,45.2 18.85,45.05 U1.1
LEDK_A2
  Top 0.254: X2.41 3.5,28.5 3.25,28.75 3.25,32.45 3.6,32.8 12.2,32.8 13.9,32.8 17.85,36.75 U1.22
LEDK_A3
  Top 0.254: X2.40 9.95,28.2 17.75,28.2 28.2,28.2 29.3,29.3 29.3,35 29.3,41.6 27.4,43.5 27.4,45.3 27,45.7 18.8,45.7 18.35,45.25 U1.2
LEDK_A4
  Top 0.254: X2.39 3.35,27.9 3.25,28 2.75,28.5 2.75,32.65 3.3,33.2 3.4,33.3 12.2,33.3 13.7,33.3 17.35,36.95 U1.21
LEDK_A5
  Top 0.254: X2.38 10.1,27.6 17.75,27.6 28.4,27.6 29.8,29 29.8,35 29.8,41.9 27.9,43.8 27.9,45.5 27.2,46.2 18.6,46.2 17.85,45.45 U1.3
LEDK_A6
  Top 0.254: X2.37 3.2,27.3 3,27.5 2.25,28.25 2.25,32.85 3.1,33.7 3.2,33.8 12.2,33.8 13.4,33.8 16.85,37.25 U1.20
LEDK_B1
  Top 0.254: X2.35 3.05,26.7 2.75,27 1.75,28 1.75,33.05 3,34.3 12.2,34.3 13.2,34.3 16.35,37.45 U1.19
LEDK_B2
  Top 0.254: X2.34 10.4,26.4 17.7,26.4 29,26.4 30.3,27.7 30.3,35 30.3,42.2 28.4,44.1 28.4,45.7 27.4,46.7 18.3,46.7 17.35,45.75 U1.4
LEDK_B3
  Top 0.254: X2.33 2.9,26.1 2.25,26.75 1.25,27.75 1.25,33.35 2.7,34.8 12.2,34.8 13,34.8 15.85,37.65 U1.18
LEDK_B4
  Top 0.254: X2.32 10.55,25.8 17.7,25.8 29.2,25.8 30.8,27.4 30.8,35 30.8,42.5 28.9,44.4 28.9,45.9 27.6,47.2 18,47.2 16.85,46.05 U1.5
LEDK_B5
  Top 0.254: X2.31 2.75,25.5 2.25,26 0.75,27.5 0.75,33.55 2.5,35.3 12.2,35.3 12.8,35.3 15.35,37.85 U1.17
LEDK_B6
  Top 0.254: X2.30 10.7,25.2 17.7,25.2 29.4,25.2 31.3,27.1 31.3,35 31.3,42.8 29.4,44.7 29.4,46.2 27.9,47.7 17.7,47.7 16.35,46.35 U1.6
MISO
  Top 0.254: R14.1 32.77,67.06 33.27,66.55 35.82,66.55 ISP1.1 37.47,68.83 38.73,70.1 38.73,71.88 42.04,75.18 IC1.6
MOSI  (via drill 0.5)
  Top 0.254: IC1.5 42.78,73.51 ISP1.4 | v27.81,70.36 26.04,70.36 SW3.B
  Bottom 0.254: ISP1.4 40.01,71.63 38.86,72.77 30.23,72.77 v27.81,70.36
N$1  (via drill 0.4)
  Top 0.28: X2.14 9.1,20.4 v9.4,20.1 | v9.4,17.8 9.4,17.3 9.8,16.9 14,16.9 14.1,16.8 14.1,16.4 14.5,16 15.3,16 15.8,16.5 16.1,16.5 16.2,16.4 16.2,16.2 16.3,16.1 16.6,16.1 16.7,16.2 16.7,16.4 17.3,17 X1.12
  Bottom 0.28: v9.4,20.1 v9.4,17.8
N$2
  Top 0.28: X2.12 8.4,19.8 8.9,19.3 9.9,19.3 10.2,19 10.2,17.5 10.3,17.4 11.7,17.4 11.8,17.5 11.8,18.1 12,18.3 12.3,18.3 12.5,18.1 12.5,17.7 12.8,17.4 14.4,17.4 14.7,17.1 14.7,16.6 14.8,16.5 15.1,16.5 15.2,16.6 15.2,16.9 15.3,17 16.6,17 17.6,18 X1.10
N$3  (via drill 0.4)
  Top 0.28: X2.18 10.4,21.6 11,21 11,20.6 v11.1,20.5 | v11.1,18.6 11.3,18.8 12.8,18.8 13,18.6 13,18.1 13.2,17.9 14.1,17.9 14.6,18.4 14.9,18.4 15,18.3 15,17.7 15.2,17.5 16.3,17.5 17.3,18.5 X1.9
  Bottom 0.28: v11.1,20.5 v11.1,18.6
N$4
  Top 0.28: X2.16 10.1,21 10.3,20.8 10.3,20 10.7,19.6 11.4,19.6 11.7,19.3 13,19.3 13.5,18.8 13.5,18.5 13.6,18.4 13.9,18.4 14,18.5 14,19.4 14.2,19.6 15.1,19.6 15.5,19.2 15.5,18.3 15.6,18.2 16,18.2 16.2,18.4 16.2,18.9 16.3,19 17.5,19 18,19.5 X1.7
N$5  (via drill 0.4)
  Top 0.28: v12.2,22 12.2,22.3 11.7,22.8 X2.22 | v12.2,20.1 13.9,20.1 14.1,20.3 14.3,20.3 14.5,20.1 15.2,20.1 15.6,20.5 15.6,20.7 15.7,20.8 16,20.8 16.1,20.7 16.1,20.2 15.9,20 15.9,19.6 16,19.5 17.2,19.5 17.7,20 X1.6
  Bottom 0.28: v12.2,20.1 v12.2,22
N$6
  Top 0.28: X2.20 10.6,22.2 11.7,21.1 12.5,21.1 13,20.6 13.7,20.6 14,20.9 14.4,20.9 14.7,20.6 15,20.6 15.1,20.7 15.1,21.2 15.3,21.4 16.3,21.4 16.6,21.1 16.6,20.2 16.7,20.1 17,20.1 17.1,20.2 17.1,20.9 17.2,21 17.6,21 17.8,20.8 17.8,20.6 17.9,20.5 18.2,20.5 18.3,20.6 18.3,20.8 18.4,20.9 18.6,20.9 18.7,20.8 18.7,20.6 18.8,20.5 19,20.5 19.1,20.6 19.1,20.9 19.2,21 X1.4
N$7  (via drill 0.4)
  Top 0.28: X2.26 12.7,24 v13.4,23.3 | v13.4,21.5 14,21.5 14.8,22.3 14.8,22.6 14.9,22.7 15.2,22.7 15.3,22.6 15.3,22.2 15.6,21.9 16.5,21.9 16.8,22.2 16.8,22.5 16.9,22.6 17.2,22.6 17.3,22.5 17.3,21.8 17.6,21.5 X1.3
  Bottom 0.28: v13.4,23.3 v13.4,21.5
N$8
  Top 0.28: X2.24 12.1,23.4 13,22.5 13.8,22.5 14.3,23 14.3,23.5 14.5,23.7 15.5,23.7 15.8,23.4 15.8,22.9 15.9,22.8 16.2,22.8 16.3,22.9 16.3,23.4 16.6,23.7 17.5,23.7 17.8,23.4 17.8,22.5 17.9,22.4 18.2,22.4 18.3,22.5 18.3,23 18.5,23.2 18.8,23.2 19,23 19,22.7 19.2,22.5 X1.1
N$9
  Top 0.254: U1.11 11.65,42.75 11.15,42.25 11.12,42.22 C2.1
N$10
  Top 0.254: U1.13 13.4,41.75 13.25,41.6 13.25,39.65 12.1,38.5 R2.1
N$11
  Top 0.254: U1.14 13.9,41.25 13.75,41.1 13.75,39.45 12.25,37.95 12.25,36.7 12.05,36.5 R3.2
N$12
  Top 0.254: U1.26 20.25,40.75 20.4,40.6 20.4,38.5 20.9,38 22.3,38 22.5,37.8 R12.2
N$13
  Top 0.254: R12.1 22.5,33.02 C3.1
N$14
  Top 0.25: R1.1 7.02,10.47 LED1.C
N$15
  Top 0.254: R4.1 24.5,38.98 R5.2 23.48,40 22.6,40 21.9,40.7 21.9,42.55 21.7,42.75 U1.30
N$16
  Top 0.254: R4.2 R8.2 26.52,35 27.4,35 27.7,35.3 27.7,39.5 26.2,41 22.65,41 22.4,41.25 22.4,43.1 22.25,43.25 U1.31
N$17
  Top 0.254: R7.2 33.75,61.25
  Top 1.27: X3.PWR 43,56.5 42.5,57 35.25,57 33.75,58.5 33.75,61.25 33.75,64.5 33,65.25 32.81,65.44 T1.2
N$19
  Top 0.254: R9.2 26.5,38.98 R8.1 26.5,36.2 26.3,36 23.7,36 23.5,36.2 23.5,38.2 22.7,39 21.4,40.3 21.4,41.6 21.25,41.75 U1.28
N$20
  Top 0.254: U1.25 19.85,40.25 19.9,40.2 19.9,38.3 20.4,37.8 20.4,37.12 R10.2
N$21
  Top 0.406: D2.C 35.05,70.74 ISP1.2
N$22
  Top 0.254: U1.32 23.23,43.75 R11.2
N$23
  Top 0.254: U1.9 13.55,43.75 12.9,44.4
  Top 1.016: Q1.3 6.47,51.93 7.2,51.2 9.5,51.2 R13.2
  Top 1.27: R13.2 11.3,51 11.7,50.6 11.7,48.2 12.9,47 12.9,44.4
N$24  (via drill 0.5)
  Top 0.254: Q1.1 3.76,58.86 v3.75,58.85 | U1.10 9.2,43.25 7.75,41.8 7.75,41.25 7.5,41 v6.7,41
  Bottom 0.254: v3.75,58.85 2.4,58.85 1.25,57.7 1.25,42.55 1.25,38.25 1.5,38 6.2,38 6.7,38.5 v6.7,41
N$25
  Top 1.676: Q1.4 4.2,56.6 3.3,55.7 3.3,49.3 4,48.6 4.97,48.6 L1.P$2
  pour Top (isolate 0.254, no thermals): 19.25,59 19.25,56 17.2,56 16.65,55.45 16.65,54 9.9,54 9.9,59.2 16.65,59.2 16.85,59
N$27
  Top 0.254: U2.5 36.98,44.75 36.98,44.76
  Top 0.813: 36.98,44.76 37.29,44.76 C14.1 C15.1 | C15.1 41.62,43.94 C12.1 C13.1 | C15.1 39.88,38.52 L2.P$2 40.44,37.96 SJ1.1
N$28  (via drill 0.5)
  Top 0.254: U2.10 34.65,47.6 34.95,47.9 35.3,47.9 35.5,48.1 v35.5,49.6 | v30.4,49.3 C11.1
  Bottom 0.254: v35.5,49.6 30.7,49.6 v30.4,49.3
N$29
  Top 0.254: U2.12 33.65,47.55 33.55,47.65 31.9,47.65 31.65,47.4 31.65,46.2 | 31.65,46.2 31.65,44.65 31.5,44.5 30.42,44.5 C11.2 | U2.13 31.7,46.25 31.65,46.2
  pour Top (isolate 0.254, no thermals): 33.15,44.75 30.95,44.75 30.95,46.05 29.85,46.05 29.85,44.85 30.85,43.85 32.8,43.85 32.8,40.4 35.1,40.4 35.1,35.6 36.2,35.6 36.2,44.75 35.65,44.75 35.65,41.45 33.65,41.45 33.65,44.25 33.15,44.25
ON/OFF  (via drill 0.5)
  Top 0.254: T1.3 30.76,63.51 29.5,62.25 29.5,61.27 | 29.5,61.27 R7.1 28.5,61.25 28.05,61.7 22.65,61.7 21.6,60.65 20.2,60.65 18.37,62.48 7.37,62.48 6.21,63.64 ON/OFF.P2 | 29.5,61.27 29.5,50.84 v28.96,50.29
  Top 0.406: T2.3 32.28,4.8 R6.1 32.26,10.16 35.05,12.95 35.05,16 35.05,17.02 36.32,18.29 36.32,22.35 v36.32,29.97
  Bottom 0.254: v28.96,50.29 28.96,42.42 33.78,37.59 33.78,32.51 v36.32,29.97
PWM  (via drill 0.5)
  Top 0.254: U1.27 20.75,41.25 20.9,41.1 20.9,39.6 v21.6,38.9 | R14.2 JP1.1 21.73,66.95 17.92,66.95 16.64,65.66 16.64,63.37 16.89,63.12 19.58,63.12 v20.6,62.1
  Bottom 0.254: v21.6,38.9 26.3,38.9 26.9,39.5 26.9,58.6 26.3,59.2 22.1,59.2 20.6,60.7 v20.6,62.1
RST  (via drill 0.5)
  Top 0.254: v38.86,77.72 IC1.1
  Bottom 0.254: ISP1.5 44.07,69.72 44.07,71.75 38.86,76.96 v38.86,77.72
SCLK
  Top 0.254: ISP1.3 40.01,68.45 41.02,69.47 43.81,69.47 44.32,69.98 44.32,76.2 44.07,76.45 IC1.7
VCC  (via drill 0.4, 0.5)
  Top 0.25: X2.6 6.7,18 6.4,18.3 6.1,18.3 v5.8,18 | X2.5 5.8,17.7 | 5.8,17.7 6.1,17.7 6.4,17.4 X2.4 | v5.8,18 5.8,17.7 | X2.7 5.5,18.3 v5.8,18
  Top 0.254: 4.95,14.05 v4.8,14.2 | IC1.8 40.89,77.72 | 40.89,77.72 39.75,76.58 39.75,74.3 37.59,72.14 34.04,72.14 33.53,71.63 33.53,67.94 v33.66,67.82 | v1.05,79 1.17,79.12 39.49,79.12 40.89,77.72
  Top 0.406: v33.66,67.82 33.91,68.07 D2.A
  Top 0.61: v1.25,10.5 LED1.A 4.95,14.05
  Top 0.813: v43.65,31.94 v42.15,31.94 v40.65,31.94 39.62,31.94 39.04,32.53 SJ1.2
  Bottom 0.254: 0.75,78.7 v1.05,79
  Bottom 0.406: 38.9,31.94 38.73,32.11 38.73,54.74 33.66,59.82 v33.66,67.82
  Bottom 0.61: v4.8,14.2 5.8,15.2 v5.8,18
  Bottom 0.813: v43.65,31.94 38.9,31.94 38.9,28.23 37.72,27.05 37.72,13.84 34.38,10.5 v1.25,10.5
VIN  (via drill 0.5)
  Top 0.254: U2.11 v34.15,48.45 | 36.05,47 36.35,47.3 36.35,51.6 36.3,51.65 | U1.12 12.75,42.25 12.5,42 12.5,40.3 12.1,39.9 9.7,39.9 9.3,39.5 9.3,38.72 R2.2
  Top 1.016: v34.15,48.45 34.15,51.25 v34.48,51.58 34.55,51.65 36.3,51.65 40.5,51.65 | 40.5,51.65 43.27,51.65 C10.1 | C9.1 40.63,51.52 40.5,51.65
  Top 1.27: T1.1 28.5,64.47 | 28.5,64.47 22.7,64.47 | v28.49,63.48 28.49,64.47 28.5,64.47 | 22.7,64.47 21.73,64.47 v21.7,64.5 18.8,64.5 C16.+ | v10.8,45.3 v9.6,45.3 5.88,45.3 L1.P$1 | TP2.P$1 23,64.17 22.7,64.47
  Bottom 0.61: v34.15,48.45 36.45,48.45 36.9,48 36.9,43.25 36.45,42.8 v34.65,42.8
  Bottom 1.27: v28.49,63.48 28.49,53.51 30.43,51.58 v34.48,51.58 | v21.7,64.5 10.99,64.5 6.4,59.91 6.4,45.9 7,45.3 v10.8,45.3
  pour Top (no thermals): 34.2,44.25 34.2,42.35 35.1,42.35 35.1,43.2 34.65,43.2 34.65,44.25
  pour Top (isolate 0.254, no thermals): 1.9,47.8 1.9,43.05 3.4,43.05 4.5,41.95 4.5,38.1 4.75,37.85 8.6,37.85 8.6,35.95 9.55,35.95 9.55,39.35 9.75,39.55 12.45,39.55 12.75,39.85 12.75,42.25 12.35,42.25 12.35,40.3 12.15,40.1 9.65,40.1 8.55,39 5.75,39.05 5.5,39.3 5.5,41.95 6.6,43.05 8.15,43.05 8.15,47.8

### Text on the board
tPlace: PWM Backlight Control | Backlight | On/Off | UP | DOWN | On | Power | Off | 9-12VDC / 1000mA | LP097QX1 | Retina iPad / DisplayPort Driver / 9.7" 2048x1536 | POWER | DisplayPort